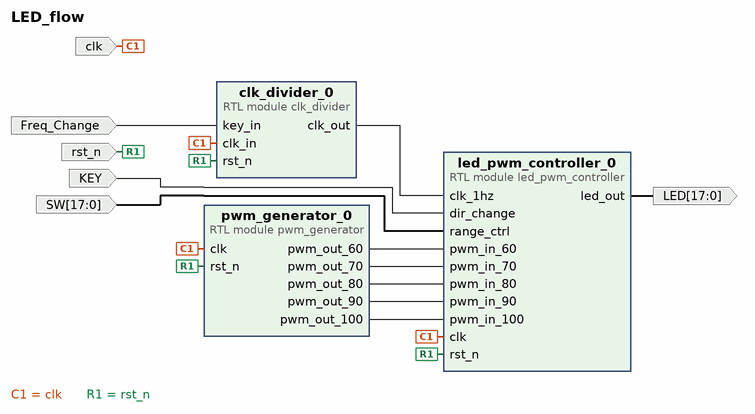
[diagram p0: block diagram of the top level]
# Vivado block design LED_flow, xc7z020clg400-1, Vivado 2022.2
create_bd_design LED_flow

create_bd_port -dir I clk
create_bd_port -dir I -type rst rst_n
create_bd_port -dir I KEY
create_bd_port -dir O -from 17 -to 0 LED
create_bd_port -dir I -from 17 -to 0 SW
create_bd_port -dir I Freq_Change

create_bd_cell -type module -reference pwm_generator pwm_generator_0
create_bd_cell -type module -reference clk_divider clk_divider_0
create_bd_cell -type module -reference led_pwm_controller led_pwm_controller_0

# ---- connections ----

connect_bd_net [get_bd_ports Freq_Change] [get_bd_pins clk_divider_0/key_in]
connect_bd_net [get_bd_ports KEY] [get_bd_pins led_pwm_controller_0/dir_change]
connect_bd_net [get_bd_ports SW] [get_bd_pins led_pwm_controller_0/range_ctrl]
connect_bd_net [get_bd_ports clk] [get_bd_pins pwm_generator_0/clk] [get_bd_pins clk_divider_0/clk_in] [get_bd_pins led_pwm_controller_0/clk]
connect_bd_net [get_bd_pins clk_divider_0/clk_out] [get_bd_pins led_pwm_controller_0/clk_1hz]
connect_bd_net [get_bd_pins led_pwm_controller_0/led_out] [get_bd_ports LED]
connect_bd_net [get_bd_pins pwm_generator_0/pwm_out_60] [get_bd_pins led_pwm_controller_0/pwm_in_60]
connect_bd_net [get_bd_pins pwm_generator_0/pwm_out_70] [get_bd_pins led_pwm_controller_0/pwm_in_70]
connect_bd_net [get_bd_pins pwm_generator_0/pwm_out_80] [get_bd_pins led_pwm_controller_0/pwm_in_80]
connect_bd_net [get_bd_pins pwm_generator_0/pwm_out_90] [get_bd_pins led_pwm_controller_0/pwm_in_90]
connect_bd_net [get_bd_pins pwm_generator_0/pwm_out_100] [get_bd_pins led_pwm_controller_0/pwm_in_100]
connect_bd_net [get_bd_ports rst_n] [get_bd_pins pwm_generator_0/rst_n] [get_bd_pins clk_divider_0/rst_n] [get_bd_pins led_pwm_controller_0/rst_n]

validate_bd_design
save_bd_design
